# Altium schematic sheet SD_Card.SchDoc: 2-Way SD Card for Loading Operating System
size A4; DocumentNumber: 15; SheetNumber: 15; SheetTotal: 16
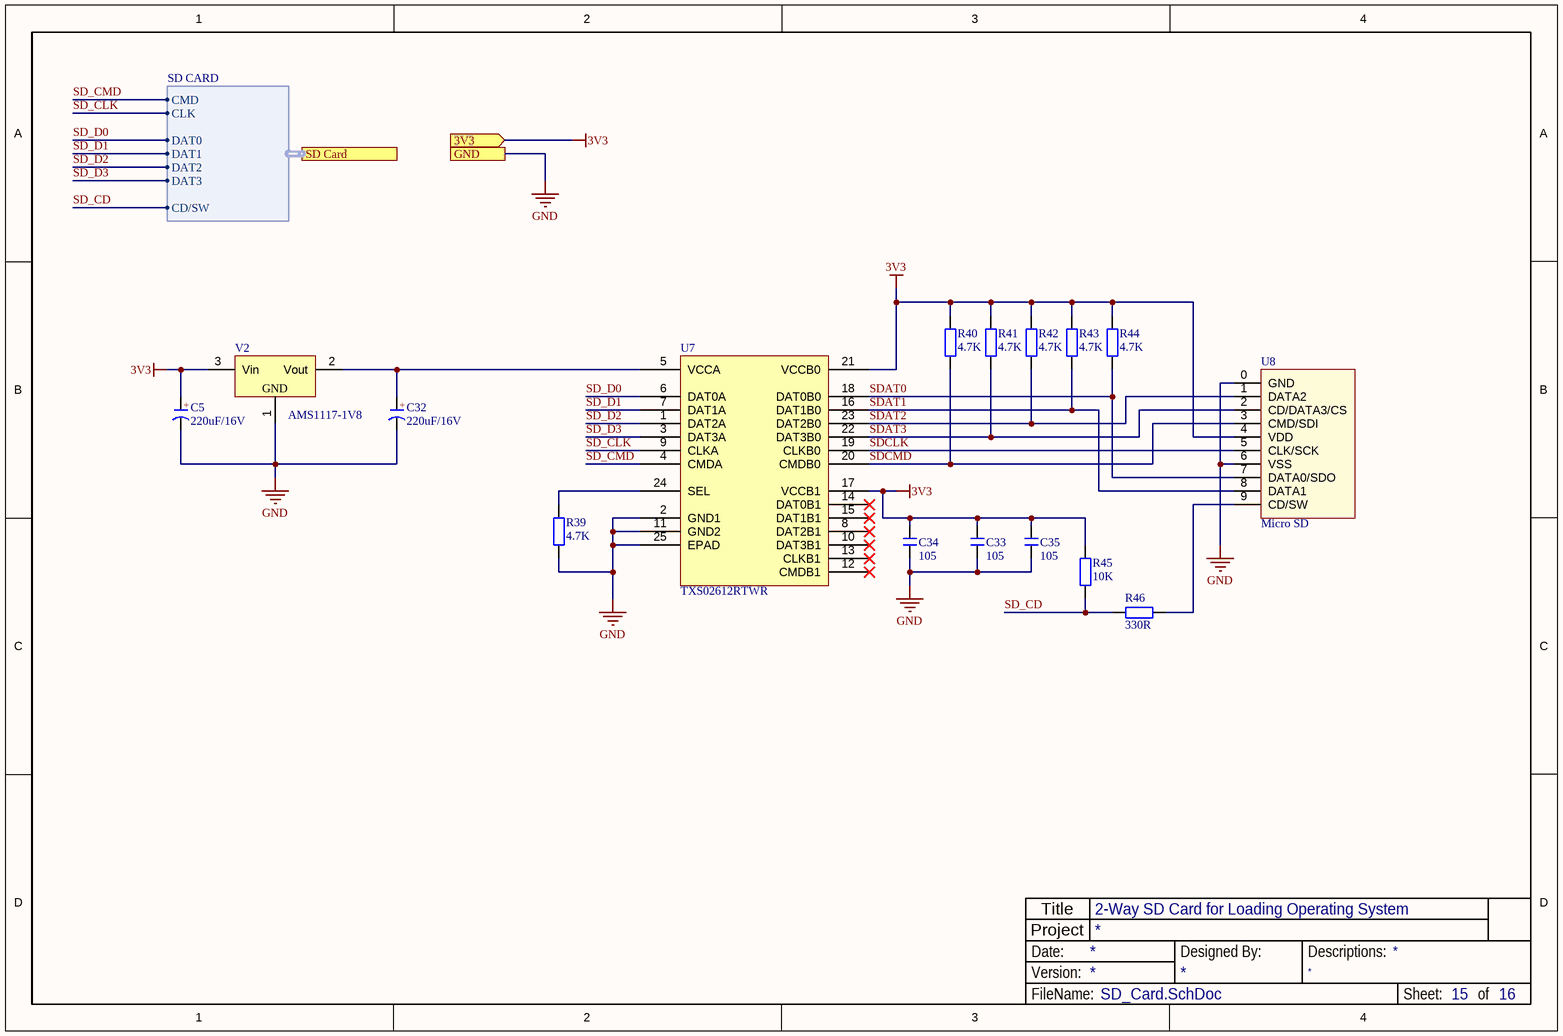
[diagram p0: SD_Card.SchDoc]

## Parts
C5  220uF/16V  [CM D(6.3*7.7)]
C32  220uF/16V  [CM D(6.3*7.7)]
C33  105  [C 0603_L]
C34  105  [C 0603_L]
C35  105  [C 0603_L]
R39  4.7K  [R 0201_L]
R40  4.7K  [R 0201_L]
R41  4.7K  [R 0201_L]
R42  4.7K  [R 0201_L]
R43  4.7K  [R 0201_L]
R44  4.7K  [R 0201_L]
R45  10K  [R 0201_L]
R46  330R  [R 0201_L]
U7  TXS02612RTWR  [QFN24_RTW]
U8  Micro SD  [Micro SD]
V2  AMS1117-1V8  [SOT223_L]

## Ports
3V3 (in), GND, SD Card (harness SD CARD)

## Harnesses
SD CARD: CMD, CLK, DAT0, DAT1, DAT2, DAT3, CD/SW

## Nets
3V3: C5.1(A) C33.2 C34.2 C35.2 R40.2 R41.2 R42.2 R43.2 R44.2 R45.2 U7.17(VCCB1) U7.21(VCCB0) U8.4(VDD) V2.3(Vin) ; port 3V3
GND: C5.2(K) C32.2(K) C33.1 C34.1 C35.1 R39.1 U7.2(GND1) U7.11(GND2) U7.25(EPAD) U8.0(GND) U8.6(VSS) V2.1(GND) ; port GND
SD_CD: R45.1 R46.2 ; port SD Card.CD/SW
SD_CLK: U7.9(CLKA) ; port SD Card.CLK
SD_CMD: U7.4(CMDA) ; port SD Card.CMD
SD_D0: U7.6(DAT0A) ; port SD Card.DAT0
SD_D1: U7.7(DAT1A) ; port SD Card.DAT1
SD_D2: U7.1(DAT2A) ; port SD Card.DAT2
SD_D3: U7.3(DAT3A) ; port SD Card.DAT3
SDAT0: R44.1 U7.18(DAT0B0) U8.7(DATA0/SDO)
SDAT1: R43.1 U7.16(DAT1B0) U8.8(DATA1)
SDAT2: R42.1 U7.23(DAT2B0) U8.1(DATA2)
SDAT3: R41.1 U7.22(DAT3B0) U8.2(CD/DATA3/CS)
SDCLK: U7.19(CLKB0) U8.5(CLK/SCK)
SDCMD: R40.1 U7.20(CMDB0) U8.3(CMD/SDI)
NetC32_1: C32.1(A) U7.5(VCCA) V2.2(Vout)
NetR39_2: R39.2 U7.24(SEL)
NetR46_1: R46.1 U8.9(CD/SW)

Not connected (* = marked no-connect by the designer): U7 8(DAT2B1)* 10(DAT3B1)* 12(CMDB1)* 13(CLKB1)* 14(DAT0B1)* 15(DAT1B1)*

## Notes on the sheet
- Title
- FileName:
- Version:
- Date:
- Project
- Designed By:
- Descriptions:
- Sheet:
- of
- (in symbol CE_SMD) +

## Library data of the parts
C5 C32 = CE_SMD: 贴片电解电容 C4054381; 版权归属: 封装库来自淘宝 ID：黄晶宝石; BOM名称: 贴片电解电容; 联系售后: https://shop463601444.taobao.com
C33-C35 = C: 贴片电容; BOM名称: 无极性贴片电容; 淘宝ID: 封装库来自淘宝 ID：黄晶宝石; 联系售后，技术支持: https://shop463601444.taobao.com; 唯一出售店铺网址: https://shop463601444.taobao.com
R39-R46 = R: 贴片电阻; 版权归属: 来自淘宝 ID：黄晶宝石; 封装库来自淘宝卖家 ID：黄晶宝石: 其他店铺购入均为盗版，不享受售后技术支持服务，请立即申请退款; BOM名称: 贴片电阻; 联系售后: https://shop463601444.taobao.com
U8 = Micro SD: Micro SD卡; 版权归属: 源创客; BOM名称: Micro SD卡; 学习资源: www.ooocke.com
V2 = AMS1117: 三端稳压芯片; BOM名称: 稳压芯片; 淘宝ID: 封装库来自淘宝 ID：黄晶宝石; 欢迎光临淘宝店铺: https://shop463601444.taobao.com